# Altium project Full_Power_Board.PrjPcb
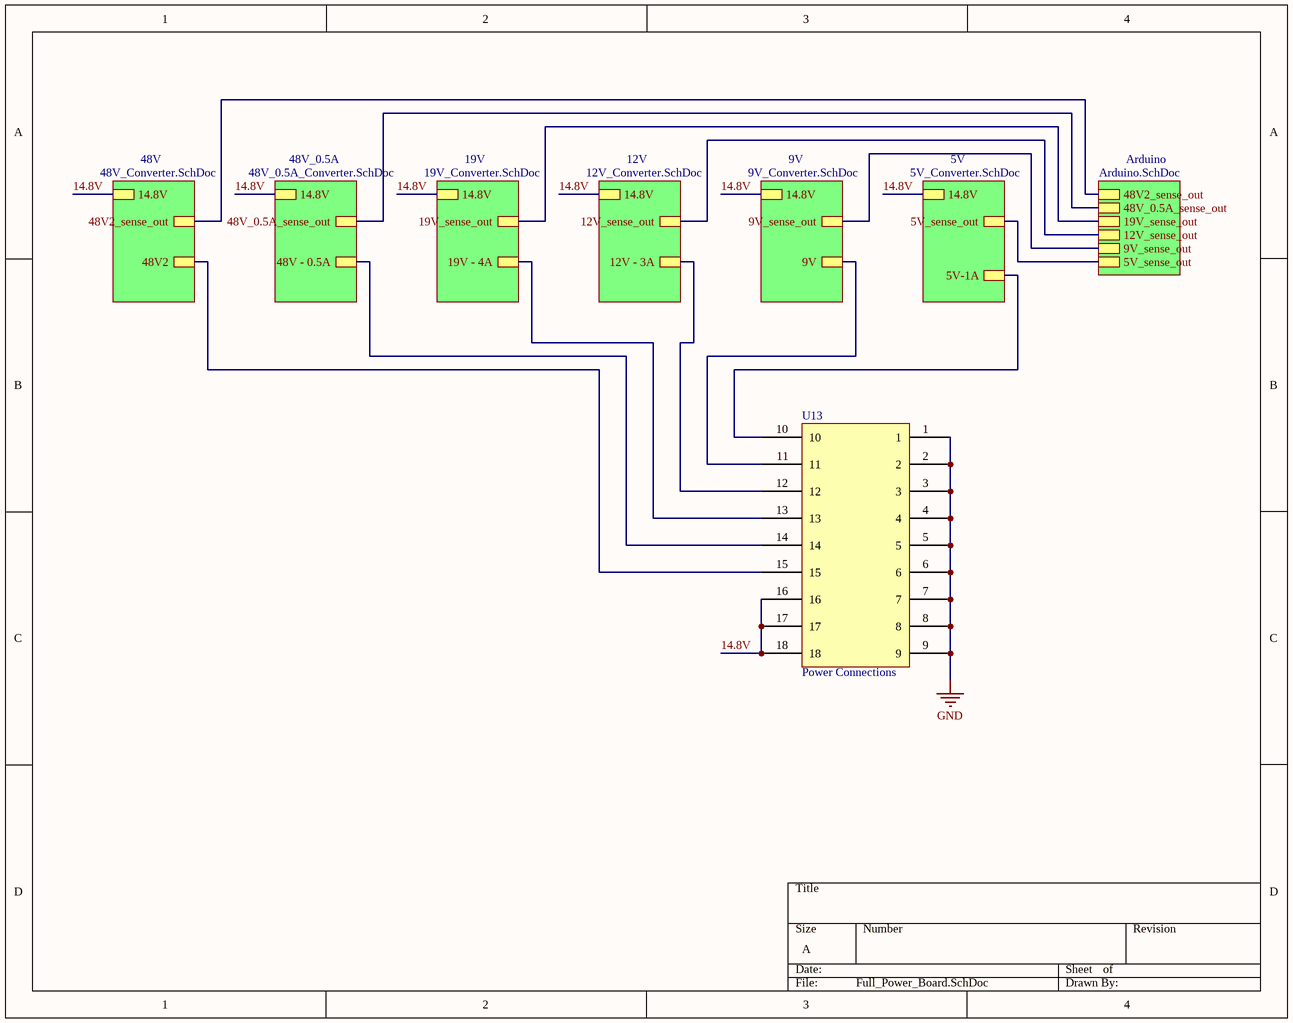
[diagram p0: Full_Power_Board.SchDoc]
5 sheets, 70 parts. Net scope: hierarchical (ports join the sheet entries above them; power ports are global).
Board file: Final_Power.PcbDoc
Sheets:
  Full_Power_Board.SchDoc
    48V = 48V_Converter.SchDoc
    48V_0.5A = 48V_0.5A_Converter.SchDoc
    19V = 19V_Converter.SchDoc
    5V = 5V_Converter.SchDoc

## Sheet Full_Power_Board.SchDoc
size A

### Parts
U13  Power Connections  [Molex Connector]

### Sub-sheets
5V = 5V_Converter.SchDoc: 14.8V, 5V_sense_out, 5V-1A
9V = 9V_Converter.SchDoc (file not in this document): 14.8V, 9V_sense_out, 9V
12V = 12V_Converter.SchDoc (file not in this document): 14.8V, 12V_sense_out, 12V - 3A
19V = 19V_Converter.SchDoc: 14.8V, 19V_sense_out, 19V - 4A
48V = 48V_Converter.SchDoc: 14.8V, 48V2, 48V2_sense_out
48V_0.5A = 48V_0.5A_Converter.SchDoc: 14.8V, 48V - 0.5A, 48V_0.5A_sense_out
Arduino = Arduino.SchDoc (file not in this document): 5V_sense_out, 9V_sense_out, 12V_sense_out, 19V_sense_out, 48V_0.5A_sense_out, 48V2_sense_out

### Nets
GND: U13.1 U13.2 U13.3 U13.4 U13.5 U13.6 U13.7 U13.8 U13.9
14.8V: U13.16 U13.17 U13.18 ; sheet 48V/14.8V, sheet 48V_0.5A/14.8V, sheet 19V/14.8V, sheet 12V/14.8V, sheet 9V/14.8V, sheet 5V/14.8V
NetR1_2: U13.10 ; sheet 5V/5V-1A
NetR22_2: U13.13 ; sheet 19V/19V - 4A
NetR33_2: U13.14 ; sheet 48V_0.5A/48V - 0.5A
NetR40_2: U13.15 ; sheet 48V/48V2
NetU2_5: sheet 5V/5V_sense_out, sheet Arduino/5V_sense_out
NetU7_5: sheet 19V/19V_sense_out, sheet Arduino/19V_sense_out
NetU9_5: sheet 48V_0.5A/48V_0.5A_sense_out, sheet Arduino/48V_0.5A_sense_out
NetU11_5: sheet 48V/48V2_sense_out, sheet Arduino/48V2_sense_out
NetU13_11: U13.11 ; sheet 9V/9V
NetU13_12: U13.12 ; sheet 12V/12V - 3A
(unnamed): sheet 12V/12V_sense_out, sheet Arduino/12V_sense_out
(unnamed): sheet 9V/9V_sense_out, sheet Arduino/9V_sense_out

### Library data of the parts
U13 = Molex Connector

## Sheet 48V_Converter.SchDoc
size A
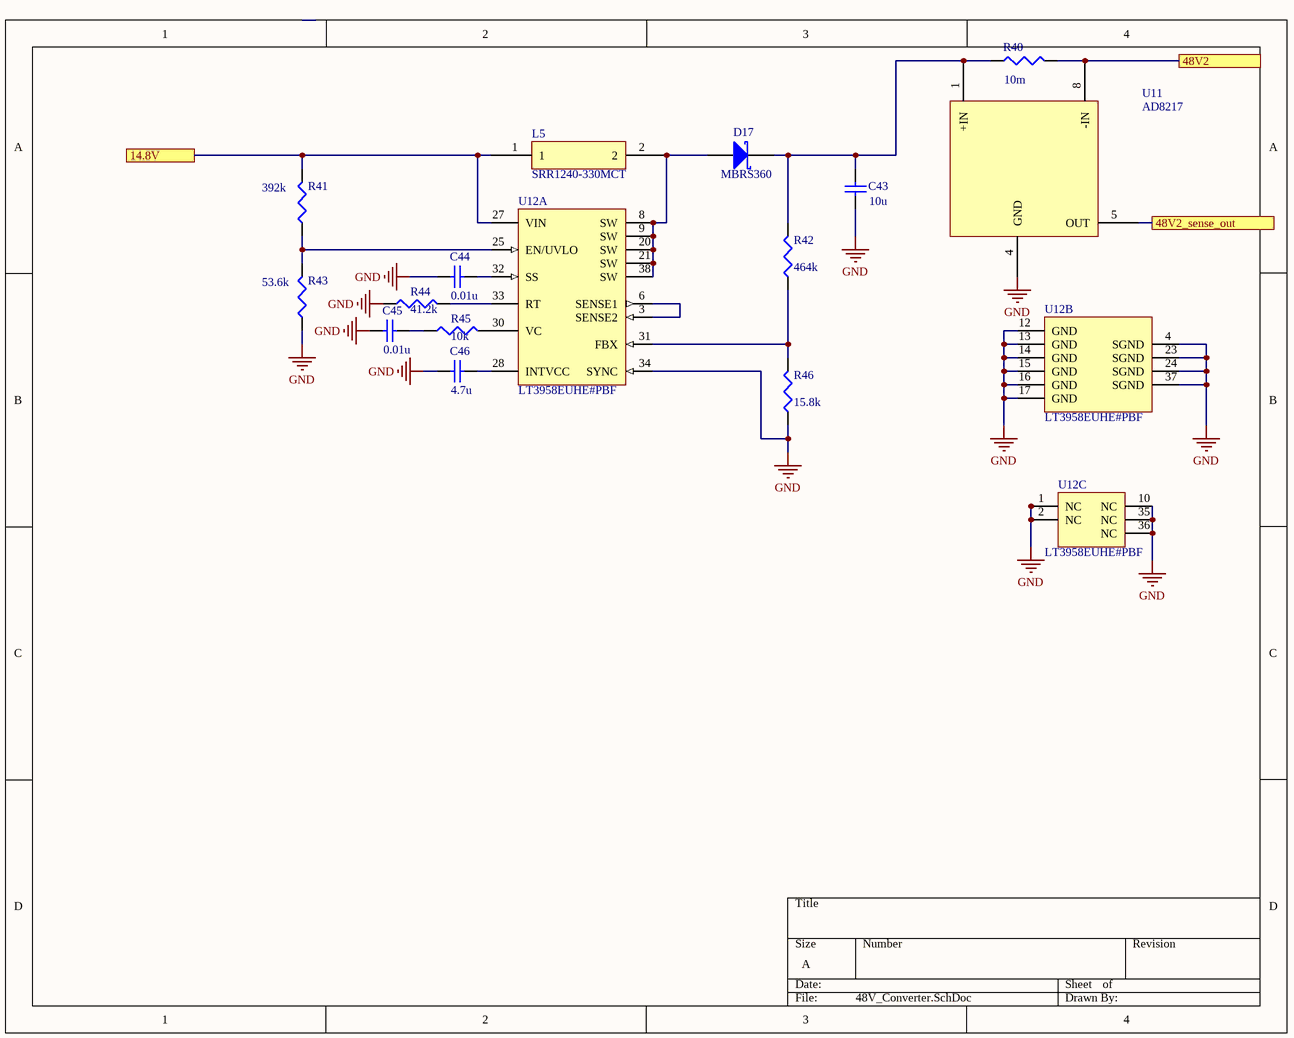
[diagram p1: 48V_Converter.SchDoc]

### Parts
C43  value 10u  [C1206]  (hidden comment: Cap Semi)
C44  value 0.01u  [C1206]  (hidden comment: Cap Semi)
C45  value 0.01u  [C1206]  (hidden comment: Cap Semi)
C46  value 4.7u  [C1206]  (hidden comment: Cap Semi)
D17  MBRS360  [SMB]
L5  SRR1240-330MCT  [SRR1240-4R7M]
R40  value 10m  [J1-0603]  (hidden comment: Res3)
R41  value 392k  [J1-0603]  (hidden comment: Res3)
R42  value 464k  [J1-0603]  (hidden comment: Res3)
R43  value 53.6k  [J1-0603]  (hidden comment: Res3)
R44  value 41.2k  [J1-0603]  (hidden comment: Res3)
R45  value 10k  [J1-0603]  (hidden comment: Res3)
R46  value 15.8k  [J1-0603]  (hidden comment: Res3)
U11  AD8217  [AD8217]
U12  LT3958EUHE#PBF  [LT3958]  (parts A,B,C of 3)

### Ports
14.8V, 48V2, 48V2_sense_out

### Nets
GND: C43.1 C44.1 C45.1 C46.1 R43.1 R44.1 R46.1 U11.4(GND) U12.1(NC) U12.2(NC) U12.4(SGND) U12.10(NC) U12.12(GND) U12.13(GND) U12.14(GND) U12.15(GND) U12.16(GND) U12.17(GND) U12.23(SGND) U12.24(SGND) U12.34(SYNC) U12.35(NC) U12.36(NC) U12.37(SGND)
14.8V: L5.1 R41.2 U12.27(VIN) ; port 14.8V
NetC43_2: C43.2 D17.2(K) R40.1 R42.2 U11.1(+IN)
NetC44_2: C44.2 U12.32(SS)
NetC45_2: C45.2 R45.1
NetC46_2: C46.2 U12.28(INTVCC)
NetD17_1: D17.1(A) L5.2 U12.8(SW) U12.9(SW) U12.20(SW) U12.21(SW) U12.38(SW)
NetR40_2: R40.2 U11.8(-IN) ; port 48V2
NetR41_1: R41.1 R43.2 U12.25(EN/UVLO)
NetR42_1: R42.1 R46.2 U12.31(FBX)
NetR44_2: R44.2 U12.33(RT)
NetR45_2: R45.2 U12.30(VC)
NetU11_5: U11.5(OUT) ; port 48V2_sense_out
NetU12_3: U12.3(SENSE2) U12.6(SENSE1)

### Library data of the parts
C43-C46 = Cap Semi: Capacitor (Semiconductor SIM Model); Published: 8-Jun-2000; LatestRevisionDate: 29-May-2009; LatestRevisionNote: IPC-7351 Footprint Added.; PackageReference: C1206; Publisher: Altium Limited; PackageDescription: Chip Capacitor
D17 = D Schottky: Schottky Diode; Published: 8-Jun-2000; LatestRevisionDate: 17-Jul-2002; LatestRevisionNote: Re-released for DXP Platform.; PackageReference: SMB; Publisher: Altium Limited; PackageDescription: DO-214-AA/SMB; 2 C-Bend Leads; Body 5.3 x 3.6 mm, inc. leads (LxW); Code_JEDEC: DO-214-AA
L5 = SRR1240-4R7MCT: Inductor
R40-R46 = Res3: Resistor; Published: 8-Jun-2000; LatestRevisionDate: 29-May-2009; LatestRevisionNote: IPC-7351 Footprint Added.; PackageReference: J1-0603; Publisher: Altium Limited; PackageDescription: Chip Resistor
U11 = AD8217: Current Shunt Moniter
U12 = LT3958EUHE#PBF: LT3958; Manufacturer: Linear Technology; Frequency Adjust Range: 100kHz - 1MHz; Number of Outputs: 1; ComponentLink1Description: Manufacturer URL; ComponentLink1URL: http://www.linear.com/; ComponentLink2Description: Datasheet; ComponentLink2URL: http://cds.linear.com/docs/en/datasheet/3958f.pdf; ComponentLink3Description: Package Specification; ComponentLink3URL: http://cds.linear.com/docs/en/packaging/QFN_28_05-08-1836.pdf; Mounting Technology: Surface Mount; PackageDescription: 28-Pin Plastic QFN, Body 5 x 6 mm, Pitch 0.5 mm; PackageReference: UHE-36; PackageVersion: Rev. D, 02/2012; PartNumber: LT3958EUHE#PBF; RoHS: TRUE; Supplier 1: Digi-Key; Supplier 2: Farnell; Supplier 3: Newark; Supplier Part Number 1: LT3958EUHE#PBF-ND; Supplier Part Number 2: 2294964; Supplier Part Number 3: 78R9566

## Sheet 48V_0.5A_Converter.SchDoc
size A
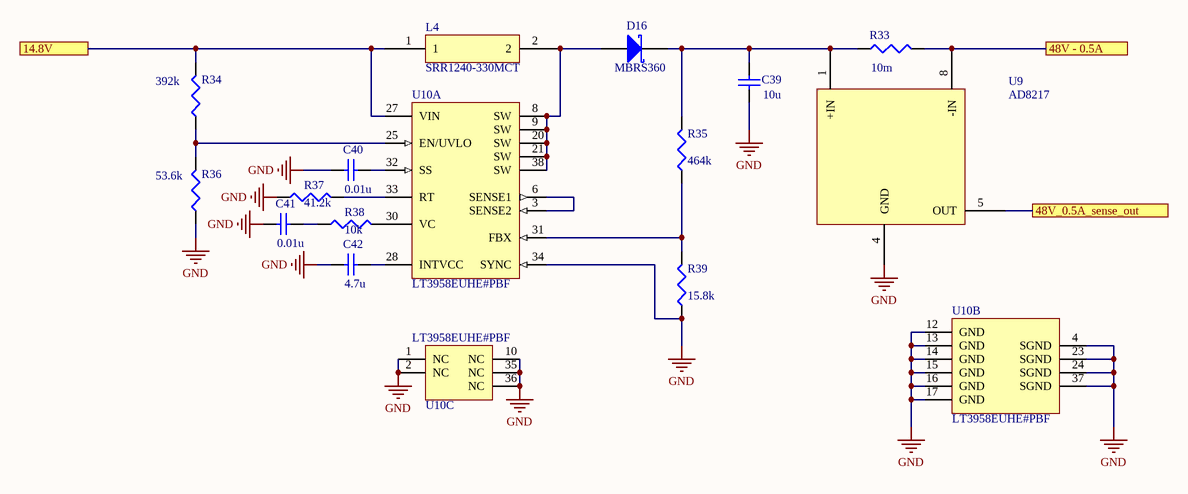
[diagram p2: 48V_0.5A_Converter.SchDoc]

### Parts
C39  value 10u  [C1206]  (hidden comment: Cap Semi)
C40  value 0.01u  [C1206]  (hidden comment: Cap Semi)
C41  value 0.01u  [C1206]  (hidden comment: Cap Semi)
C42  value 4.7u  [C1206]  (hidden comment: Cap Semi)
D16  MBRS360  [SMB]
L4  SRR1240-330MCT  [SRR1240-4R7M]
R33  value 10m  [J1-0603]  (hidden comment: Res3)
R34  value 392k  [J1-0603]  (hidden comment: Res3)
R35  value 464k  [J1-0603]  (hidden comment: Res3)
R36  value 53.6k  [J1-0603]  (hidden comment: Res3)
R37  value 41.2k  [J1-0603]  (hidden comment: Res3)
R38  value 10k  [J1-0603]  (hidden comment: Res3)
R39  value 15.8k  [J1-0603]  (hidden comment: Res3)
U9  AD8217  [AD8217]
U10  LT3958EUHE#PBF  [LT3958]  (parts A,B,C of 3)

### Ports
14.8V, 48V - 0.5A, 48V_0.5A_sense_out

### Nets
GND: C39.1 C40.1 C41.1 C42.1 R36.1 R37.1 R39.1 U9.4(GND) U10.1(NC) U10.2(NC) U10.4(SGND) U10.10(NC) U10.12(GND) U10.13(GND) U10.14(GND) U10.15(GND) U10.16(GND) U10.17(GND) U10.23(SGND) U10.24(SGND) U10.34(SYNC) U10.35(NC) U10.36(NC) U10.37(SGND)
14.8V: L4.1 R34.2 U10.27(VIN) ; port 14.8V
NetC39_2: C39.2 D16.2(K) R33.1 R35.2 U9.1(+IN)
NetC40_2: C40.2 U10.32(SS)
NetC41_2: C41.2 R38.1
NetC42_2: C42.2 U10.28(INTVCC)
NetD16_1: D16.1(A) L4.2 U10.8(SW) U10.9(SW) U10.20(SW) U10.21(SW) U10.38(SW)
NetR33_2: R33.2 U9.8(-IN) ; port 48V - 0.5A
NetR34_1: R34.1 R36.2 U10.25(EN/UVLO)
NetR35_1: R35.1 R39.2 U10.31(FBX)
NetR37_2: R37.2 U10.33(RT)
NetR38_2: R38.2 U10.30(VC)
NetU9_5: U9.5(OUT) ; port 48V_0.5A_sense_out
NetU10_3: U10.3(SENSE2) U10.6(SENSE1)

### Library data of the parts
C39-C42 = Cap Semi: Capacitor (Semiconductor SIM Model); Published: 8-Jun-2000; LatestRevisionDate: 29-May-2009; LatestRevisionNote: IPC-7351 Footprint Added.; PackageReference: C1206; Publisher: Altium Limited; PackageDescription: Chip Capacitor
D16 = D Schottky: Schottky Diode; Published: 8-Jun-2000; LatestRevisionDate: 17-Jul-2002; LatestRevisionNote: Re-released for DXP Platform.; PackageReference: SMB; Publisher: Altium Limited; PackageDescription: DO-214-AA/SMB; 2 C-Bend Leads; Body 5.3 x 3.6 mm, inc. leads (LxW); Code_JEDEC: DO-214-AA
L4 = SRR1240-4R7MCT: Inductor
R33-R39 = Res3: Resistor; Published: 8-Jun-2000; LatestRevisionDate: 29-May-2009; LatestRevisionNote: IPC-7351 Footprint Added.; PackageReference: J1-0603; Publisher: Altium Limited; PackageDescription: Chip Resistor
U9 = AD8217: Current Shunt Moniter
U10 = LT3958EUHE#PBF: as U12 on sheet 48V_Converter; ComponentLink1Description: Manufacturer URL; ComponentLink1URL: http://www.linear.com/; ComponentLink2Description: Datasheet; ComponentLink2URL: http://cds.linear.com/docs/en/datasheet/3958f.pdf; ComponentLink3Description: Package Specification; ComponentLink3URL: http://cds.linear.com/docs/en/packaging/QFN_28_05-08-1836.pdf; Mounting Technology: Surface Mount; PackageDescription: 28-Pin Plastic QFN, Body 5 x 6 mm, Pitch 0.5 mm; PackageReference: UHE-36; PackageVersion: Rev. D, 02/2012; PartNumber: LT3958EUHE#PBF; RoHS: TRUE; Supplier 1: Digi-Key; Supplier 2: Farnell; Supplier 3: Newark; Supplier Part Number 1: LT3958EUHE#PBF-ND; Supplier Part Number 2: 2294964; Supplier Part Number 3: 78R9566

## Sheet 19V_Converter.SchDoc
size A
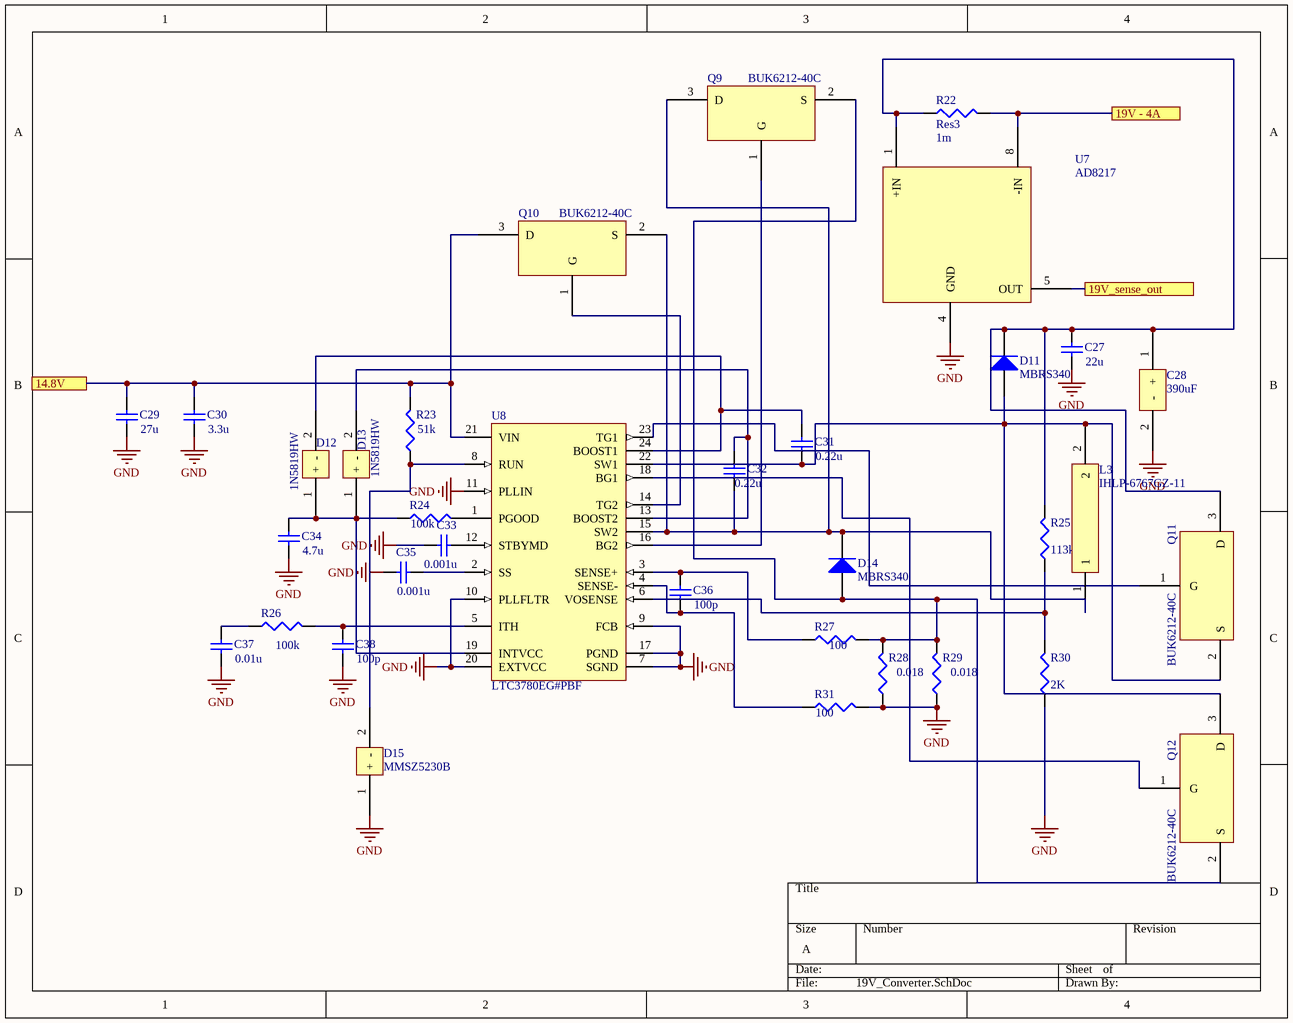
[diagram p3: 19V_Converter.SchDoc]

### Parts
C27  value 22u  [C1206]  (hidden comment: Cap Semi)
C28  390uF  [PCV1E391MCL2GS]
C29  value 27u  [C1206]  (hidden comment: Cap Semi)
C30  value 3.3u  [C1206]  (hidden comment: Cap Semi)
C31  value 0.22u  [C1206]  (hidden comment: Cap Semi)
C32  value 0.22u  [C1206]  (hidden comment: Cap Semi)
C33  value 0.001u  [C1206]  (hidden comment: Cap Semi)
C34  value 4.7u  [C1206]  (hidden comment: Cap Semi)
C35  value 0.001u  [C1206]  (hidden comment: Cap Semi)
C36  value 100p  [C1206]  (hidden comment: Cap Semi)
C37  value 0.01u  [C1206]  (hidden comment: Cap Semi)
C38  value 100p  [C1206]  (hidden comment: Cap Semi)
D11  MBRS340  [SMC]
D12  1N5819HW  [1N5819HW]
D13  1N5819HW  [1N5819HW]
D14  MBRS340  [SMC]
D15  MMSZ5230B  [MMSZ5230B]
L3  IHLP-6767GZ-11  [IHLP-6767GZ-11]
Q9  BUK6212-40C  [BUK6212-40C]
Q10  BUK6212-40C  [BUK6212-40C]
Q11  BUK6212-40C  [BUK6212-40C]
Q12  BUK6212-40C  [BUK6212-40C]
R22  Res3  value 1m  [14-1210]
R23  value 51k  [J1-0603]  (hidden comment: Res3)
R24  value 100k  [J1-0603]  (hidden comment: Res3)
R25  value 113k  [J1-0603]  (hidden comment: Res3)
R26  value 100k  [J1-0603]  (hidden comment: Res3)
R27  value 100  [J1-0603]  (hidden comment: Res3)
R28  value 0.018  [14-1210]  (hidden comment: Res3)
R29  value 0.018  [14-1210]  (hidden comment: Res3)
R30  value 2K  [J1-0603]  (hidden comment: Res3)
R31  value 100  [J1-0603]  (hidden comment: Res3)
U7  AD8217  [AD8217]
U8  LTC3780EG#PBF  [LTC3780 24-Leaqd Plastic SSOP]

### Ports
14.8V, 19V - 4A, 19V_sense_out

### Nets
GND: C27.1 C28.2(-) C29.1 C30.1 C33.1 C34.1 C35.1 C37.1 C38.1 D15.1(+) R28.1 R29.1 R30.1 R31.2 U7.4(GND) U8.7(SGND) U8.9(FCB) U8.10(PLLFLTR) U8.11(PLLIN) U8.17(PGND) U8.20(EXTVCC)
14.8V: C29.2 C30.2 Q10.3(D) R23.2 U8.21(VIN) ; port 14.8V
NetC27_2: C27.2 C28.1(+) D11.2(K) Q11.3(D) R22.1 R25.2 U7.1(+IN)
NetC31_1: C31.1 D11.1(A) L3.2 Q11.2(S) Q12.3(D) U8.22(SW1)
NetC31_2: C31.2 D12.2(-) U8.24(BOOST1)
NetC32_1: C32.1 D14.2(K) L3.1 Q9.3(D) Q10.2(S) U8.15(SW2)
NetC32_2: C32.2 D13.2(-) U8.13(BOOST2)
NetC33_2: C33.2 U8.12(STBYMD)
NetC34_2: C34.2 D12.1(+) D13.1(+) R24.1 U8.19(INTVCC)
NetC35_2: C35.2 U8.2(SS)
NetC36_1: C36.1 R31.1 U8.4(SENSE-)
NetC36_2: C36.2 R27.1 U8.3(SENSE+)
NetC37_2: C37.2 R26.1
NetC38_2: C38.2 R26.2 U8.5(ITH)
NetD14_1: D14.1(A) Q9.2(S) Q12.2(S) R27.2 R28.2 R29.2
NetD15_2: D15.2(-) R23.1 U8.8(RUN)
NetQ9_1: Q9.1(G) U8.16(BG2)
NetQ10_1: Q10.1(G) U8.14(TG2)
NetQ11_1: Q11.1(G) U8.23(TG1)
NetQ12_1: Q12.1(G) U8.18(BG1)
NetR22_2: R22.2 U7.8(-IN) ; port 19V - 4A
NetR24_2: R24.2 U8.1(PGOOD)
NetR25_1: R25.1 R30.2 U8.6(VOSENSE)
NetU7_5: U7.5(OUT) ; port 19V_sense_out

### Library data of the parts
C27 C29-C38 = Cap Semi: Capacitor (Semiconductor SIM Model); Published: 8-Jun-2000; LatestRevisionDate: 29-May-2009; LatestRevisionNote: IPC-7351 Footprint Added.; PackageReference: C1206; Publisher: Altium Limited; PackageDescription: Chip Capacitor
C28 = PCV1E391MCL2GS: Aluminum Capacitor
D11 D14 = Diode: Default Diode; Published: 8-Jun-2000; LatestRevisionDate: 17-Jul-2002; LatestRevisionNote: Re-released for DXP Platform.; PackageVersion: Sep-1996; PackageReference: SMC; Publisher: Altium Limited; PackageDescription: DO-214-AB/SMC; 2 C-Bend Leads; Body 7.9 x 5.9 mm, inc. leads (LxW); Code_JEDEC: DO-214-AB
D12 D13 = 1N5819HW: 1A Schottky Barrier Rectifier
D15 = MMSZ5230B: Zener Diode
L3 = IHLP-6767GZ-11: Inductor
Q9-Q12 = BUK6212-40C: N-Channel TrenchMOS Intermediate Level FET
R22-R31 = Res3: Resistor; Published: 8-Jun-2000; LatestRevisionDate: 29-May-2009; LatestRevisionNote: IPC-7351 Footprint Added.; PackageReference: J1-0603; Publisher: Altium Limited; PackageDescription: Chip Resistor
U7 = AD8217: Current Shunt Moniter
U8 = LTC3780EG#PBF: Buck-boost Controller, Constant Frequency, Current Mode Control with Power Good Output, 24-pin SOP (G-24), -40 to 85 degC, Pb-Free; Manufacturer: Linear Technology; Frequency Sync Range: 200kHz - 400kHz; Number of Outputs: 1; PackageDesciption: 24-Pin Plastic SSOP, Body 8.2 x 5.3 mm, Pitch 0.65 mm; ComponentLink1Description: Manufacturer URL; ComponentLink1URL: http://www.linear.com/; ComponentLink2Description: Datasheet; ComponentLink2URL: http://cds.linear.com/docs/en/datasheet/3780ff.pdf; ComponentLink3Description: Package Specification; ComponentLink3URL: http://cds.linear.com/docs/en/packaging/SSOP_24_05-08-1640.pdf; DatasheetVersion: Rev. F; Mounting Technology: Surface Mount; PackageReference: G-24; PackageVersion: Jun-10; PartNumber: LTC3780EG#PBF; RoHS: TRUE; Supplier 1: Digi-Key; Supplier 2: Farnell; Supplier 3: Newark; Supplier Part Number 1: LTC3780EG#PBF-ND; Supplier Part Number 2: 1273545; Supplier Part Number 3: 56M8395

## Sheet 5V_Converter.SchDoc
size A
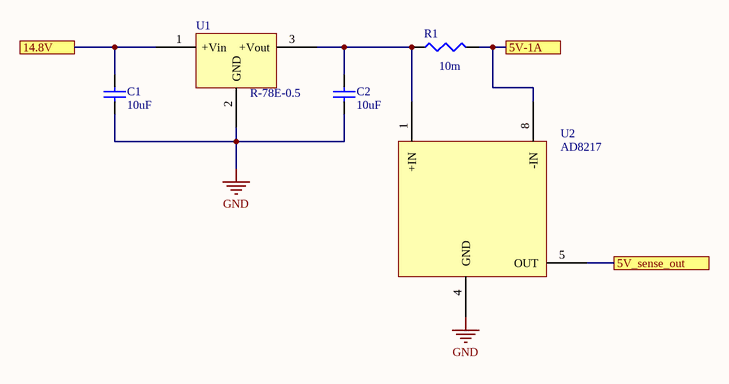
[diagram p4: 5V_Converter.SchDoc]

### Parts
C1  10uF  [C1206]
C2  10uF  [C1206]
R1  value 10m  [J1-0603]  (hidden comment: Res3)
U1  R-78E-0.5  [R-78E-0.5]
U2  AD8217  [AD8217]

### Ports
5V-1A, 5V_sense_out, 14.8V

### Nets
GND: C1.1 C2.1 U1.2(GND) U2.4(GND)
14.8V: C1.2 U1.1(+Vin) ; port 14.8V
NetC2_2: C2.2 R1.1 U1.3(+Vout) U2.1(+IN)
NetR1_2: R1.2 U2.8(-IN) ; port 5V-1A
NetU2_5: U2.5(OUT) ; port 5V_sense_out

### Library data of the parts
C1 C2 = Cap Semi: Capacitor (Semiconductor SIM Model); Published: 8-Jun-2000; LatestRevisionDate: 29-May-2009; LatestRevisionNote: IPC-7351 Footprint Added.; PackageReference: C1206; Publisher: Altium Limited; PackageDescription: Chip Capacitor; Value: 10uF
R1 = Res3: Resistor; Published: 8-Jun-2000; LatestRevisionDate: 29-May-2009; LatestRevisionNote: IPC-7351 Footprint Added.; PackageReference: J1-0603; Publisher: Altium Limited; PackageDescription: Chip Resistor
U1 = R-78E-0.5: DC/DC Converter
U2 = AD8217: Current Shunt Moniter

## Nets that join several sheets
GND: Full_Power_Board (9 pins), 48V_Converter (24 pins), 48V_0.5A_Converter (24 pins), 19V_Converter (21 pins), 5V_Converter (C1.1 C2.1 U1.2 U2.4)
14.8V: Full_Power_Board (U13.16 U13.17 U13.18), 48V_Converter (L5.1 R41.2 U12.27), 48V_0.5A_Converter (L4.1 R34.2 U10.27), 19V_Converter (5 pins), 5V_Converter (C1.2 U1.1)
NetR1_2: Full_Power_Board (U13.10), 5V_Converter (R1.2 U2.8)
NetR22_2: Full_Power_Board (U13.13), 19V_Converter (R22.2 U7.8)
NetR33_2: Full_Power_Board (U13.14), 48V_0.5A_Converter (R33.2 U9.8)
NetR40_2: Full_Power_Board (U13.15), 48V_Converter (R40.2 U11.8)